# EAGLE schematic berlinerUhrSCH (EAGLE 9.7.0)
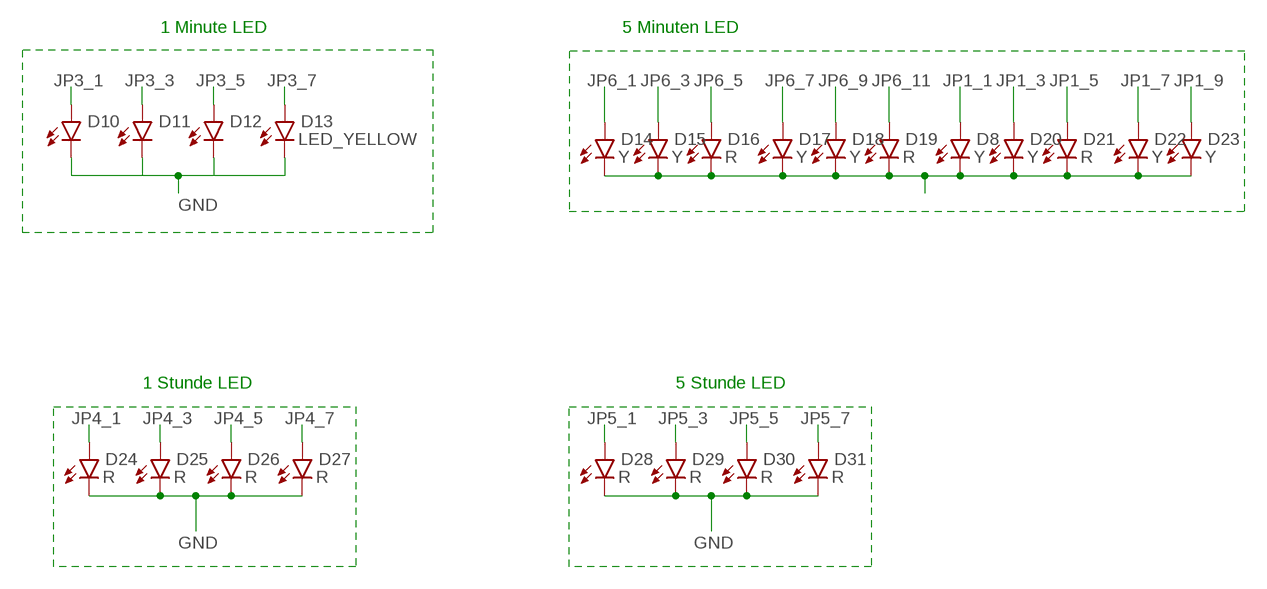
[diagram p0: schematic, sheet 1, part 1 of 2]
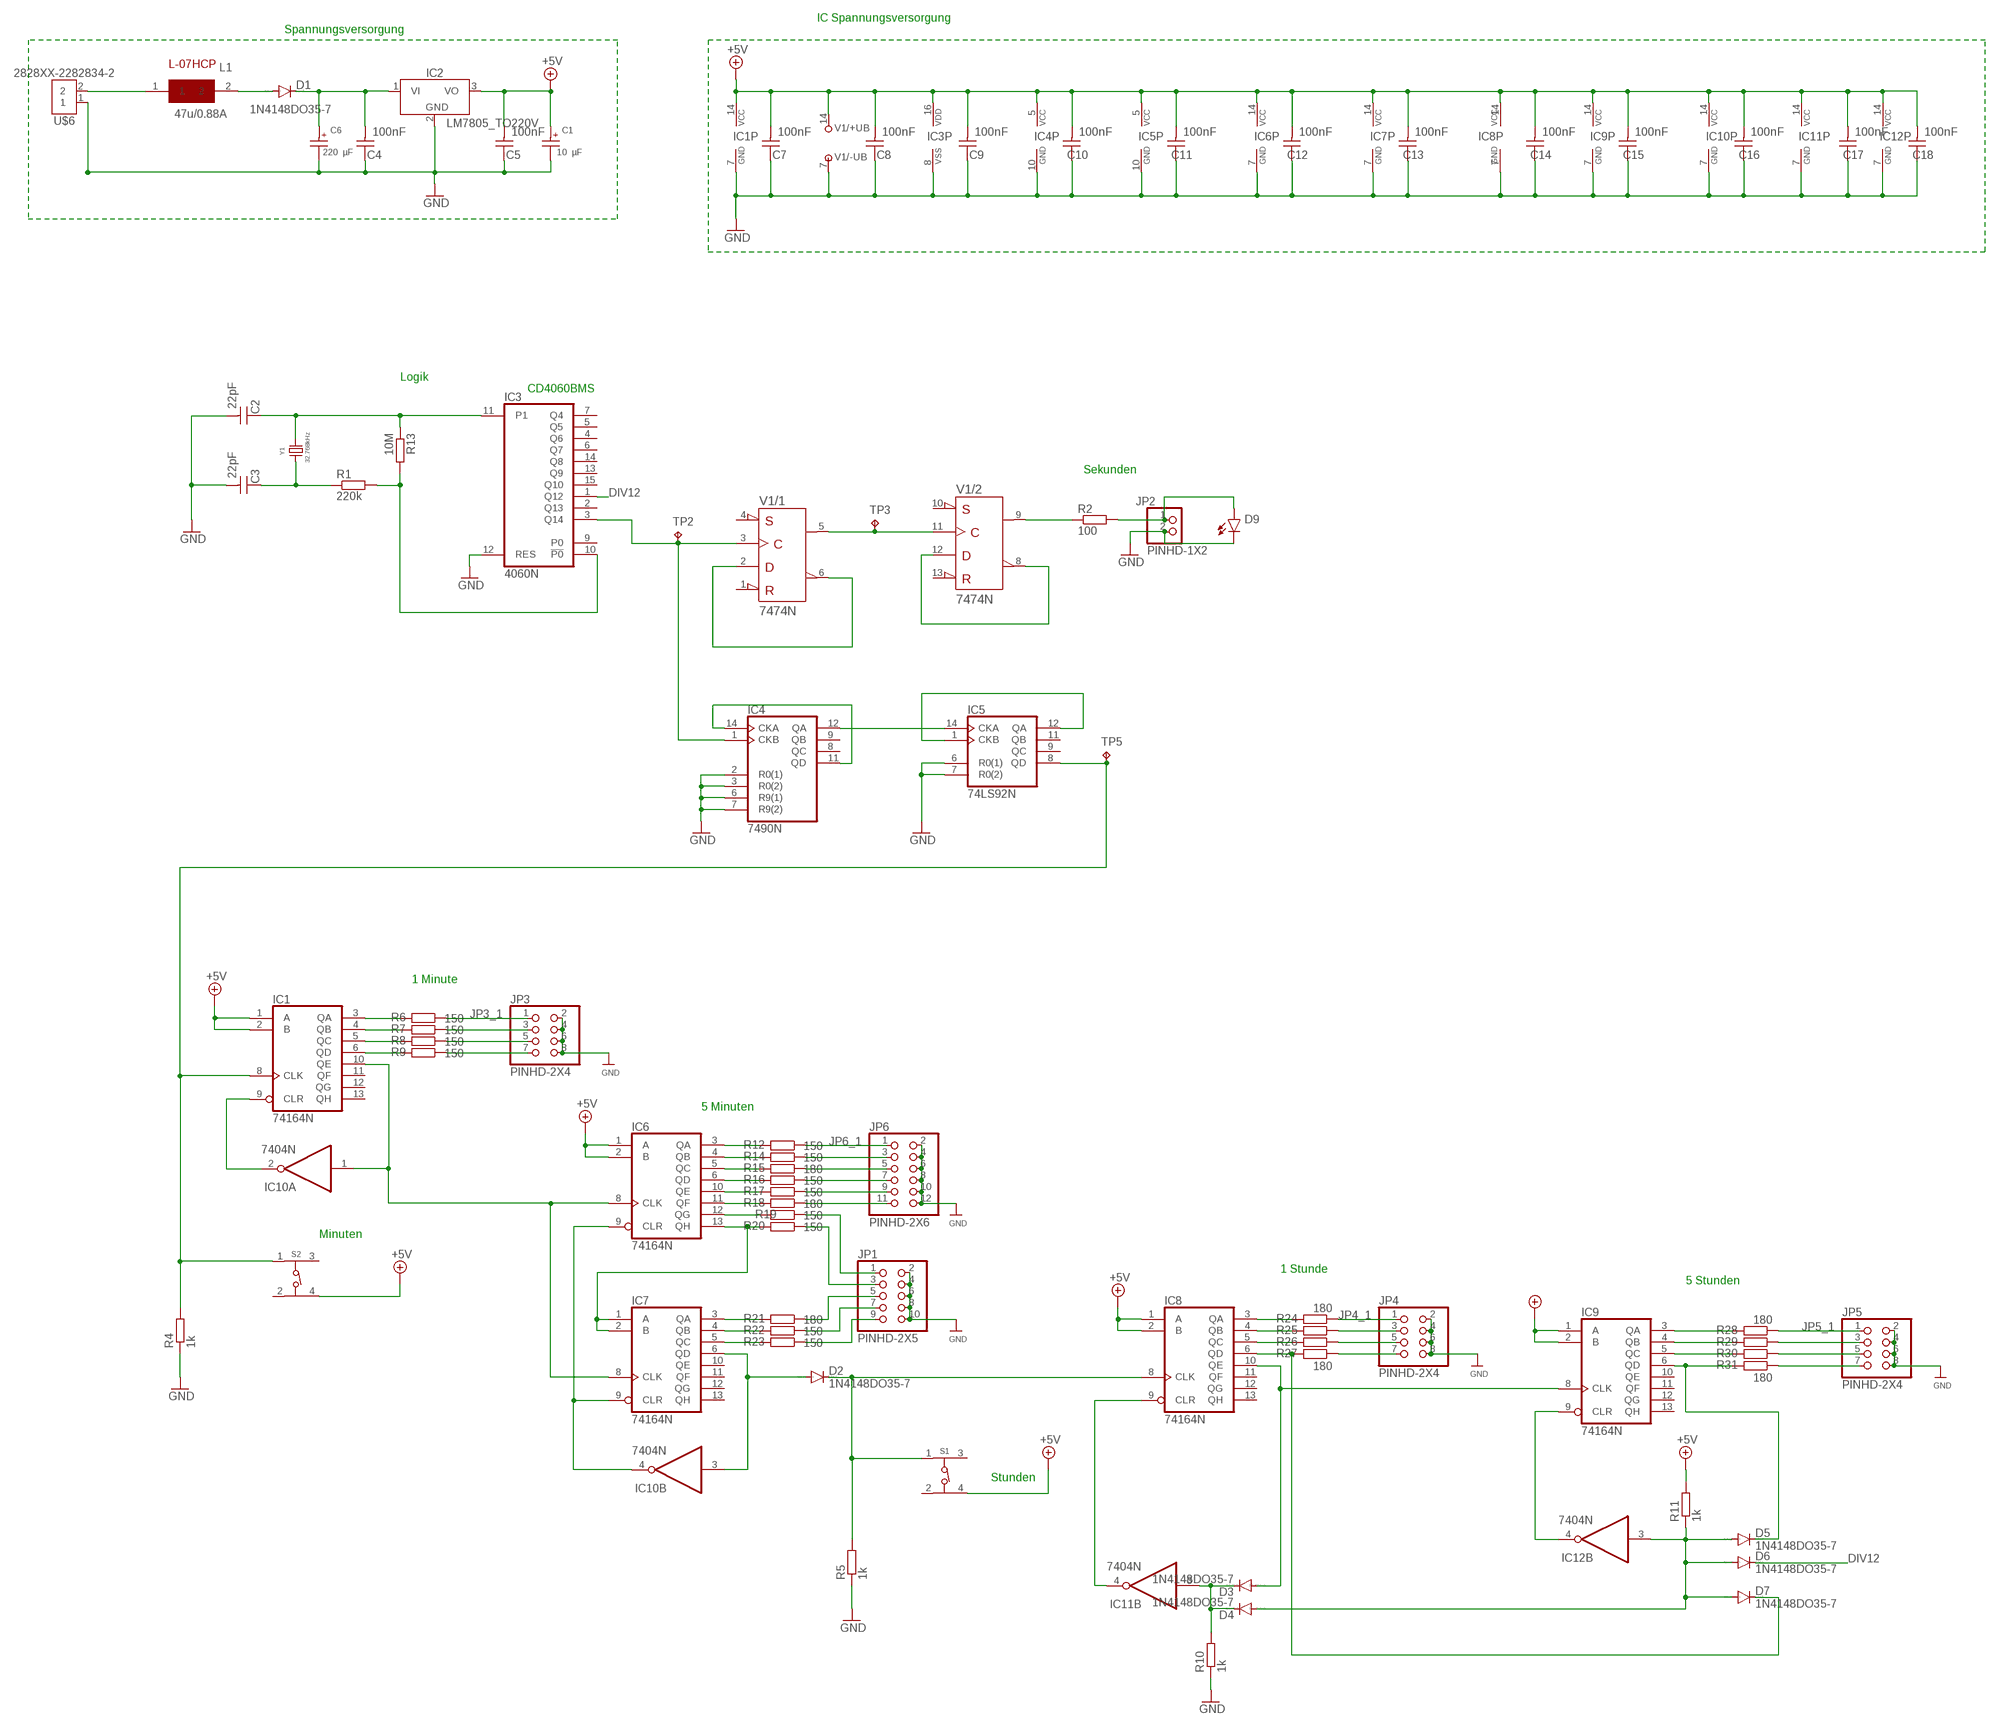
[diagram p1: schematic, sheet 1, part 2 of 2]

## Parts
C1  10 µF  WCAP-ATG8_10X12.5_860010275014  [WCAP-ATG8_10X12.5(DXL)]
C2  22pF  WCAP-CSGP_0805_H1.25_885012007067_50V(DC)  [WCAP-CSGP_0805_H1.25_R]
C3  22pF  WCAP-CSGP_0805_H1.25_885012007067_50V(DC)  [WCAP-CSGP_0805_H1.25_R]
C4  100nF  WCAP-CSGP_0805_H1.25_885012007067_50V(DC)  [WCAP-CSGP_0805_H1.25_R]
C5  100nF  WCAP-CSGP_0805_H1.25_885012007067_50V(DC)  [WCAP-CSGP_0805_H1.25_R]
C6  220 µF  WCAP-ATG8_10X12.5_860010275014  [WCAP-ATG8_10X12.5(DXL)]
C7  100nF  WCAP-CSGP_0805_H1.25_885012007067_50V(DC)  [WCAP-CSGP_0805_H1.25_R]
C8  100nF  WCAP-CSGP_0805_H1.25_885012007067_50V(DC)  [WCAP-CSGP_0805_H1.25_R]
C9  100nF  WCAP-CSGP_0805_H1.25_885012007067_50V(DC)  [WCAP-CSGP_0805_H1.25_R]
C10  100nF  WCAP-CSGP_0805_H1.25_885012007067_50V(DC)  [WCAP-CSGP_0805_H1.25_R]
C11  100nF  WCAP-CSGP_0805_H1.25_885012007067_50V(DC)  [WCAP-CSGP_0805_H1.25_R]
C12  100nF  WCAP-CSGP_0805_H1.25_885012007067_50V(DC)  [WCAP-CSGP_0805_H1.25_R]
C13  100nF  WCAP-CSGP_0805_H1.25_885012007067_50V(DC)  [WCAP-CSGP_0805_H1.25_R]
C14  100nF  WCAP-CSGP_0805_H1.25_885012007067_50V(DC)  [WCAP-CSGP_0805_H1.25_R]
C15  100nF  WCAP-CSGP_0805_H1.25_885012007067_50V(DC)  [WCAP-CSGP_0805_H1.25_R]
C16  100nF  WCAP-CSGP_0805_H1.25_885012007067_50V(DC)  [WCAP-CSGP_0805_H1.25_R]
C17  100nF  WCAP-CSGP_0805_H1.25_885012007067_50V(DC)  [WCAP-CSGP_0805_H1.25_R]
C18  100nF  WCAP-CSGP_0805_H1.25_885012007067_50V(DC)  [WCAP-CSGP_0805_H1.25_R]
D1  1N4148DO35-7  [DO35-7]
D2  1N4148DO35-7  [DO35-7]
D3  1N4148DO35-7  [DO35-7]
D4  1N4148DO35-7  [DO35-7]
D5  1N4148DO35-7  [DO35-7]
D6  1N4148DO35-7  [DO35-7]
D7  1N4148DO35-7  [DO35-7]
D8  Y  LED_RADIAL_YELLOW  [LEDRD254W60D565H860B_Y]
D9  LED_YELLOW  LED_RADIAL_YELLOW  [LEDRD254W60D565H860B_Y]
D10  LED_YELLOW  LED_RADIAL_YELLOW  [LEDRD254W60D565H860B_Y]
D11  LED_YELLOW  LED_RADIAL_YELLOW  [LEDRD254W60D565H860B_Y]
D12  LED_YELLOW  LED_RADIAL_YELLOW  [LEDRD254W60D565H860B_Y]
D13  LED_YELLOW  LED_RADIAL_YELLOW  [LEDRD254W60D565H860B_Y]
D14  Y  LED_RADIAL_YELLOW  [LEDRD254W60D565H860B_Y]
D15  Y  LED_RADIAL_YELLOW  [LEDRD254W60D565H860B_Y]
D16  R  LED_RADIAL_RED  [LEDRD254W60D565H860B]
D17  Y  LED_RADIAL_YELLOW  [LEDRD254W60D565H860B_Y]
D18  Y  LED_RADIAL_YELLOW  [LEDRD254W60D565H860B_Y]
D19  R  LED_RADIAL_RED  [LEDRD254W60D565H860B]
D20  Y  LED_RADIAL_YELLOW  [LEDRD254W60D565H860B_Y]
D21  R  LED_RADIAL_RED  [LEDRD254W60D565H860B]
D22  Y  LED_RADIAL_YELLOW  [LEDRD254W60D565H860B_Y]
D23  Y  LED_RADIAL_YELLOW  [LEDRD254W60D565H860B_Y]
D24  R  LED_RADIAL_RED  [LEDRD254W60D565H860B]
D25  R  LED_RADIAL_RED  [LEDRD254W60D565H860B]
D26  R  LED_RADIAL_RED  [LEDRD254W60D565H860B]
D27  R  LED_RADIAL_RED  [LEDRD254W60D565H860B]
D28  R  LED_RADIAL_RED  [LEDRD254W60D565H860B]
D29  R  LED_RADIAL_RED  [LEDRD254W60D565H860B]
D30  R  LED_RADIAL_RED  [LEDRD254W60D565H860B]
D31  R  LED_RADIAL_RED  [LEDRD254W60D565H860B]
IC1  74164N  [DIL14]
IC2  LM7805_TO220V  [TO220V]
IC3  4060N  [DIL16]
IC4  7490N  [DIL14]
IC5  74LS92N  [DIL14]
IC6  74164N  [DIL14]
IC7  74164N  [DIL14]
IC8  74164N  [DIL14]
IC9  74164N  [DIL14]
IC10  7404N  [DIL14]
IC11  7404N  [DIL14]
IC12  7404N  [DIL14]
JP1  PINHD-2X5  [2X05]
JP2  PINHD-1X2  [1X02]
JP3  PINHD-2X4  [2X04]
JP4  PINHD-2X4  [2X04]
JP5  PINHD-2X4  [2X04]
JP6  PINHD-2X6  [2X06]
L1  47u/0.88A  L-07HCP  [L-07HCP]
R1  220k  R_CHIP-1206(3216-METRIC)  [RESC3216X70]
R2  100  R_CHIP-1206(3216-METRIC)  [RESC3216X70]
R4  1k  R_CHIP-1206(3216-METRIC)  [RESC3216X70]
R5  1k  R_CHIP-1206(3216-METRIC)  [RESC3216X70]
R6  150  R_CHIP-1206(3216-METRIC)  [RESC3216X70]
R7  150  R_CHIP-1206(3216-METRIC)  [RESC3216X70]
R8  150  R_CHIP-1206(3216-METRIC)  [RESC3216X70]
R9  150  R_CHIP-1206(3216-METRIC)  [RESC3216X70]
R10  1k  R_CHIP-1206(3216-METRIC)  [RESC3216X70]
R11  1k  R_CHIP-1206(3216-METRIC)  [RESC3216X70]
R12  150  R_CHIP-1206(3216-METRIC)  [RESC3216X70]
R13  10M  R_CHIP-1206(3216-METRIC)  [RESC3216X70]
R14  150  R_CHIP-1206(3216-METRIC)  [RESC3216X70]
R15  180  R_CHIP-1206(3216-METRIC)  [RESC3216X70]
R16  150  R_CHIP-1206(3216-METRIC)  [RESC3216X70]
R17  150  R_CHIP-1206(3216-METRIC)  [RESC3216X70]
R18  180  R_CHIP-1206(3216-METRIC)  [RESC3216X70]
R19  150  R_CHIP-1206(3216-METRIC)  [RESC3216X70]
R20  150  R_CHIP-1206(3216-METRIC)  [RESC3216X70]
R21  180  R_CHIP-1206(3216-METRIC)  [RESC3216X70]
R22  150  R_CHIP-1206(3216-METRIC)  [RESC3216X70]
R23  150  R_CHIP-1206(3216-METRIC)  [RESC3216X70]
R24  180  R_CHIP-1206(3216-METRIC)  [RESC3216X70]
R25  180  R_CHIP-1206(3216-METRIC)  [RESC3216X70]
R26  180  R_CHIP-1206(3216-METRIC)  [RESC3216X70]
R27  180  R_CHIP-1206(3216-METRIC)  [RESC3216X70]
R28  180  R_CHIP-1206(3216-METRIC)  [RESC3216X70]
R29  180  R_CHIP-1206(3216-METRIC)  [RESC3216X70]
R30  180  R_CHIP-1206(3216-METRIC)  [RESC3216X70]
R31  180  R_CHIP-1206(3216-METRIC)  [RESC3216X70]
S1  430156070736  [4301X60707X6]
S2  430156070736  [4301X60707X6]
TP2  TPB1,27  [B1,27]
TP3  TPB1,27  [B1,27]
TP5  TPB1,27  [B1,27]
U$6  2828XX-2282834-2  [TERMBLK_254-2N]
V1  7474N  [DIL14]
Y1  32.768kHz  WE-XTAL_CFPX-56_830025159  [WE-XTAL_CFPX-56]

## Nets
1S: D9.1(A) JP2.1 R2.2
+5V: C1.1(+) C5.2 C7.2 C8.2 C9.2 C10.2 C11.2 C12.2 C13.2 C14.2 C15.2 C16.2 C17.2 C18.2 IC1.1(A) IC1.2(B) IC1.14(VCC) IC2.3(VO) IC3.16(VDD) IC4.5(VCC) IC5.5(VCC) IC6.1(A) IC6.2(B) IC6.14(VCC) IC7.14(VCC) IC8.1(A) IC8.2(B) IC8.14(VCC) IC9.1(A) IC9.2(B) IC9.14(VCC) IC10.14(P:VCC) IC11.14(P:VCC) IC12.14(P:VCC) R11.2 S1.4 S2.4 V1.14(/+UB:+UB)
DIV12: D6.C IC3.1(Q12)
GND: C1.2(-) C2.2 C3.2 C4.1 C5.1 C6.2(-) C7.1 C8.1 C9.1 C10.1 C11.1 C12.1 C13.1 C14.1 C15.1 C16.1 C17.1 C18.1 D9.2(C) D10.2(C) D13.2(C) D24.2(C) D25.2(C) D26.2(C) D27.2(C) D28.2(C) D29.2(C) D30.2(C) D31.2(C) IC1.7(GND) IC2.2(GND) IC3.8(VSS) IC3.12(RES) IC4.2(R0(1)) IC4.3(R0(2)) IC4.6(R9(1)) IC4.7(R9(2)) IC4.10(GND) IC5.6(R0(1)) IC5.7(R0(2)) IC5.10(GND) IC6.7(GND) IC7.7(GND) IC8.7(GND) IC9.7(GND) IC10.7(P:GND) IC11.7(P:GND) IC12.7(P:GND) JP1.2 JP1.4 JP1.6 JP1.8 JP1.10 JP2.2 JP3.2 JP3.4 JP3.6 JP3.8 JP4.2 JP4.4 JP4.6 JP4.8 JP5.2 JP5.4 JP5.6 JP5.8 JP6.2 JP6.4 JP6.6 JP6.8 JP6.10 JP6.12 R4.1 R5.1 R10.1 U$6.1 V1.7(/-UB:-UB)
JP1_1: D8.1(A) JP1.1 R19.1
JP1_3: D20.1(A) JP1.3 R20.1
JP1_5: D21.1(A) JP1.5 R21.1
JP1_7: D22.1(A) JP1.7 R22.1
JP1_9: D23.1(A) JP1.9 R23.1
JP3_1: D10.1(A) JP3.1 R6.1
JP3_3: D11.1(A) JP3.3 R7.1
JP3_5: D12.1(A) JP3.5 R8.1
JP3_7: D13.1(A) JP3.7 R9.1
JP4_1: D24.1(A) JP4.1 R24.1
JP4_3: D25.1(A) JP4.3 R25.1
JP4_5: D26.1(A) JP4.5 R26.1
JP4_7: D27.1(A) JP4.7 R27.1
JP5_1: D28.1(A) JP5.1 R28.1
JP5_3: D29.1(A) JP5.3 R29.1
JP5_5: D30.1(A) JP5.5 R30.1
JP5_7: D31.1(A) JP5.7 R31.1
JP6_1: D14.1(A) JP6.1 R12.1
JP6_3: D15.1(A) JP6.3 R14.1
JP6_5: D16.1(A) JP6.5 R15.1
JP6_7: D17.1(A) JP6.7 R16.1
JP6_9: D18.1(A) JP6.9 R17.1
JP6_11: D19.1(A) JP6.11 R18.1
N$1: C4.2 C6.1(+) D1.C IC2.1(VI)
N$3: D1.A L1.2
N$4: C3.1 R1.1 Y1.1
N$5: C2.1 IC3.11(P1) R13.1 Y1.2
N$6: IC3.10(!P0) R1.2 R13.2
N$7: IC3.3(Q14) IC4.1(CKB) TP2.TP V1.3(/1:CLK)
N$8: TP3.TP V1.5(/1:Q) V1.11(/2:CLK)
N$9: V1.2(/1:D) V1.6(/1:!Q)
N$10: V1.8(/2:!Q) V1.12(/2:D)
N$11: R2.1 V1.9(/2:Q)
N$13: IC4.11(QD) IC4.14(CKA)
N$14: IC4.12(QA) IC5.14(CKA)
N$15: IC5.1(CKB) IC5.12(QA)
N$16: IC1.8(CLK) IC5.8(QD) R4.2 S2.1 TP5.TP
N$17: IC1.3(QA) R6.2
N$18: IC6.13(QH) IC7.1(A) IC7.2(B) R20.2
N$19: IC1.10(QE) IC6.8(CLK) IC7.8(CLK) IC10.1(A:I)
N$20: IC1.9(CLR) IC10.2(A:O)
N$21: IC6.9(CLR) IC7.9(CLR) IC10.4(B:O)
N$22: IC8.9(CLR) IC11.4(B:O)
N$23: IC8.3(QA) R24.2
N$24: D2.C IC8.8(CLK) R5.2 S1.1
N$25: D3.A IC8.10(QE) IC9.8(CLK)
N$26: D4.A D5.A D6.A D7.A IC12.3(B:I) R11.1
N$27: IC9.9(CLR) IC12.4(B:O)
N$29: D3.C D4.C IC11.3(B:I) R10.2
N$30: D8.2(C) D14.2(C) D15.2(C) D16.2(C) D17.2(C) D18.2(C) D19.2(C) D20.2(C) D21.2(C) D22.2(C) D23.2(C)
N$31: D7.C IC8.6(QD) R27.2
N$32: IC1.4(QB) R7.2
N$34: IC1.5(QC) R8.2
N$36: IC1.6(QD) R9.2
N$38: IC6.3(QA) R12.2
N$39: L1.1 U$6.2
N$40: IC6.4(QB) R14.2
N$42: IC6.5(QC) R15.2
N$44: IC6.6(QD) R16.2
N$46: IC6.10(QE) R17.2
N$48: IC6.11(QF) R18.2
N$50: IC6.12(QG) R19.2
N$52: IC7.4(QB) R22.2
N$54: IC7.3(QA) R21.2
N$57: IC7.5(QC) R23.2
N$59: D2.A IC7.6(QD) IC10.3(B:I)
N$61: IC8.4(QB) R25.2
N$63: IC8.5(QC) R26.2
N$66: IC9.3(QA) R28.2
N$68: IC9.4(QB) R29.2
N$70: IC9.5(QC) R30.2
N$72: D5.C IC9.6(QD) R31.2
N$75: D12.2(C)
N$76: D11.2(C)
Unconnected: IC1.11(QF) IC1.12(QG) IC1.13(QH) IC3.2(Q13) IC3.4(Q6) IC3.5(Q5) IC3.6(Q7) IC3.7(Q4) IC3.9(P0) IC3.13(Q9) IC3.14(Q8) IC3.15(Q10) IC4.8(QC) IC4.9(QB) IC5.9(QC) IC5.11(QB) IC7.10(QE) IC7.11(QF) IC7.12(QG) IC7.13(QH) IC8.11(QF) IC8.12(QG) IC8.13(QH) IC9.10(QE) IC9.11(QF) IC9.12(QG) IC9.13(QH) IC10.5(C:I) IC10.6(C:O) IC10.8(D:O) IC10.9(D:I) IC10.10(E:O) IC10.11(E:I) IC10.12(F:O) IC10.13(F:I) IC11.1(A:I) IC11.2(A:O) IC11.5(C:I) IC11.6(C:O) IC11.8(D:O) IC11.9(D:I) IC11.10(E:O) IC11.11(E:I) IC11.12(F:O) IC11.13(F:I) IC12.1(A:I) IC12.2(A:O) IC12.5(C:I) IC12.6(C:O) IC12.8(D:O) IC12.9(D:I) IC12.10(E:O) IC12.11(E:I) IC12.12(F:O) IC12.13(F:I) S1.2 S1.3 S2.2 S2.3 V1.1(/1:!CLR) V1.4(/1:!PRE) V1.10(/2:!PRE) V1.13(/2:!CLR)

## Notes on the sheet
- IC Spannungsversorgung
- Spannungsversorgung
- 1 Minute LED | 5 Minuten LED
- 1 Stunde LED | 5 Stunde LED
- Logik
- CD4060BMS
- Sekunden
- 1 Minute
- 5 Minuten
- Minuten
- 1 Stunde
- 5 Stunden
- Stunden

## Library data of the parts
C1 C6 = Wurth_Capacitors_WCAP-ATG8:WCAP-ATG8_10X12.5: WCAP-ATG8 Aluminium Electrolytic Capacitors General Purpose +85 °C Characteristics General purpose product series with max. operating temperature of +85 °C Wide range of capacitance value Mounting style: THT Radial Capacitance range: 0.1 µF ‒ 33000 µF Capacitance tolerance: ±20 % Voltage range (UR): 10 ‒ 400 V(DC) Operating temperature: -40 °C up to +85 °C for UR < 400 V(DC) -25 °C up to +85 °C for UR ≥ 400 V(DC) Endurance: 2000 h @ +85 °C Dimensions (DxL) in mm: 5.0 x 11.0 up to 22.0 x 51.0 Recommended soldering: Wave soldering Applications Filtering Smoothing Energy storage Coupling <https://www.we-online.com/catalog/media/o35732v209%20WCAP-ATG8_4C.jpg> Details see: https://www.we-online.com/catalog/en/WCAP-ATG8/ Updated by yingchun,Shan;2020-02-27 2020(C) Würth Elektronik; DATASHEET-URL: https://www.we-online.com/catalog/datasheet/860010275014.pdf; DF: 19%; DIAMETER: 10mm; I-LEAK: 82uA; I-RIPPLE: 671mA; L: 12.5mm; OPERATING-TEMPERATURE: -40 °C up to +85 °C; PART-NUMBER: 860010275014; PITCH: 5mm; TECHNICAL-REFERENCE: ATBF125821M010DSPA9B000; VALUE: 820 µF; VR: 10V(DC)
C2-C5 C7-C18 = Wurth_Capacitors_WCAP-CSGP:WCAP-CSGP_0805_H1.25: WCAP-CSGP MLCCs 0805 General Purpose Characteristics General purpose product series High performance ceramic High electrical precision and stability ceramic especially for NP0 Minimal aging especially for NP0 Mounting style: SMT-Chip Ceramic: NP0 (Class I), X5R (Class II), X7R (Class II) Temperature coefficient: ±30 ppm/°C; ±0.54 % for NP0 ±15 % for X5R and X7R Operating temperature: -55 °C up to + 125 °C for NP0 and X7R -55 °C up to + 85 °C for X5R Termination: Cu/Ni/Sn Recommended soldering: Reflow soldering Wave soldering for size 0603 Wave soldering for size 0805 (only valid for the thickness ≤0.85 mm) Applications Temperature compensation (NP0) Coupling Decoupling Bypass Smoothing Filtering Resonant circuit <https://www.we-online.com/catalog/media/o177837v209%20MLCC_GRP_all.jpg> Details see: https://www.we-online.com/catalog/en/pbs/capacitors/multilayer_ceramic_chip_capacitors/mlcc_general_purpose Updated by Ella Wu 2022-09-02 2022(C) Würth Elektronik; CERAMIC-TYPE: NP0 Class I; DATASHEET-URL: https://www.we-online.com/redexpert/spec/885012007067?ae; DF: -; HEIGHT: 1.25mm; MOUNT: SMT; OPERATING-TEMPERATURE: -55 up to +125 °C; PART-NUMBER: 885012007067; QMIN: 1000; RISO: -; SIZE: 0805; TECHNICAL-REFERENCE: NP00805472J050DFCT10000; VALUE: 4.7nF; VR: 50V(DC)
D1 = diode:1N4148: DIODE high speed (Philips); SPICEMODEL: 1N4148Nexperia; SPICEMODELTEXT: *********************************************************** \n* \n* 1N4148 \n* \n* Nexperia \n* \n* High-speed diodes \n* IFmax = 200mA \n* VRmax = 100V \n* VFmax = 1V @ IF = 10mA \n* IRmax = 25nA @ VR = 20V \n* \n* \n* \n* Package pinning does not match Spice model pinning. \n* Package: SOD27 (DO-35) \n* \n* Package Pin 1: Cathode \n* Package Pin 2: Anode \n* \n* \n* \n* Extraction date (week/year): # \n* Simulator: PSPICE \n* \n*********************************************************** \n* \n* The resistor R1 does not reflect \n* a physical device. Instead it \n* improves modeling in the reverse \n* mode of operation. \n* \n.SUBCKT 1N4148 1 2 \nR1 1 2 5.827E+9 \nD1 1 2 1N4148 \n* \n.MODEL 1N4148 D \n+ IS = 4.352E-9 \n+ N = 1.906 \n+ BV = 110 \n+ IBV = 0.0001 \n+ RS = 0.6458 \n+ CJO = 7.048E-13 \n+ VJ = 0.869 \n+ M = 0.03 \n+ FC = 0.5 \n+ TT = 3.48E-9 \n.ENDS \n*; SPICEPREFIX: X
D2-D7 = diode:1N4148: DIODE high speed (Philips)
D8 D14 D15 D17 D18 D20 D22 D23 = Opto-Electronic:LED_RADIAL: LED - Generic; CATEGORY: Opto-Electronic; SUB-CATEGORY: LED; VALUE: LED_YELLOW
D9-D13 = Opto-Electronic:LED_RADIAL: LED - Generic; CATEGORY: Opto-Electronic; SUB-CATEGORY: LED
D16 D19 D21 D24-D31 = Opto-Electronic:LED_RADIAL: LED - Generic; CATEGORY: Opto-Electronic; SUB-CATEGORY: LED; VALUE: LED_RED
IC1 IC6-IC9 = 74xx-eu:74*164: 8-bit parallel out SHIFT REGISTER
IC2 = IC_Power-Management:LM7805: 5V Voltage Regulator Reference Datasheet <https://www.ti.com/lit/ds/symlink/lm340.pdf>; CATEGORY: IC_Linear; DESCRIPTION: 5V Voltage Regulator; MANUFACTURER: Generic; MPN: Generic; SERIES: LM7805; SUB-CATEGORY: Voltage Regulator; TYPE: 5V
IC3 = 40xx:4060: 14-stage binary/ripple COUNTER; SPICEPREFIX: X
IC4 = 74xx-eu:74*90: Decade, divide by twelve and binary COUNTER
IC5 = 74xx-eu:74*92: Decade, divide by twelve and binary COUNTER
IC10-IC12 = 74xx-eu:74*04: Hex INVERTER
JP1 = Connector:PINHD-2X5: PIN HEADER; CATEGORY: CONNECTOR; SUB-CATEGORY: PIN-HEADER
JP2 = Connector:PINHD-1X2: PIN HEADER; CATEGORY: CONNECTOR; SUB-CATEGORY: PIN-HEADER
JP3-JP5 = Connector:PINHD-2X4: PIN HEADER; CATEGORY: CONNECTOR; SUB-CATEGORY: PIN-HEADER
JP6 = Connector:PINHD-2X6: PIN HEADER; CATEGORY: CONNECTOR; SUB-CATEGORY: PIN-HEADER
L1 = InductorExtra:L-07HCP
R1 R2 R4-R31 = Resistor:R: Resistor Fixed - Generic; CATEGORY: Resistor; SUB-CATEGORY: Fixed
S1 S2 = Wurth_Switch_WS-TATV:430156070736: WS-TATV THT Tact Switch 6x6 mm Material Properties Cover Material : Stainless Steel Properties Actuator Material:LCP Actuator Flammability Rating:UL94 V-0 Actuator Color:Black; Salmon; White Frame Material:PPA Frame Flammability Rating:UL94 HB Frame Color:Black Contact Material:Stainless Steel Contact Plating:Silver Terminal Material:Copper Alloy Terminal Plating:Silver VR:12 V (DC) Contact Resistance Initial:100 mΩ Contact Resistance After Life Test:2 Ω RISO:100 MΩ Withstanding Voltage:250 V (AC) Washable:No Qty.:200 Mechanical Properties Stroke 0.25 mm General Information Operating Temperature:-40 up to +85 °C Washable:No Packaging Properties Packaging:Bulk <https://www.we-online.com/catalog/media/o61106v209%20Family_WS_TST_THT_4301x6xxx7x6_pf2.jpg> Details see: https://www.we-online.com/catalog/en/TATV_6X6_THT_4301x6xxx7x6/ Updated by yingchun,Shan;2020-02-21 2020(C) Würth Elektronik; DATASHEET-URL: https://www.we-online.com/catalog/datasheet/430156070736.pdf; H: 7.0mm; OPERATION-FORCE: 360g; PART-NUMBER: 430156070736; QTY: 200
TP2 TP3 TP5 = testpad:TP: Test pad
U$6 = Connector:2828XX-2: 2 Position Wire to Board Terminal Block Horizontal with Board Datasheet <https://www.te.com.cn/commerce/DocumentDelivery/DDEController?Action=showdoc&DocId=Catalog+Section%7F1308389_EUROSTYLE_TERMINAL_BLOCKS%7F0607%7Fpdf%7FEnglish%7FENG_CS_1308389_EUROSTYLE_TERMINAL_BLOCKS_0607.pdf%7F2-282837-5>
V1 = 74ttl-din:74*74: Dual D type positive edge triggered FLIP FLOP, preset and clear
Y1 = Wurth_Quartz Crystals & Oscillators_WE-XTAL:WE-XTAL_CFPX-56: WE-XTAL Watch Crystals Characteristics SMT and THT models Hermetically sealed Frequency: 32.768 kHz Tolerances down to ±10 ppm available Characteristics Microprocessor Real Time Clocks Test and Measurement Equipment Battery powered Applications <https://www.we-online.com/catalog/media/o162740v209%20Family_WE-XTAL_WatchCrystal.jpg> Details see: https://www.we-online.com/catalog/en/WE-XTAL_WATCHCRYSTAL Updated by Ella Wu, 2020-10-30 2020 (C) Wurth Elektronik; C-LOAD: 12.5pF; DATASHEET-URL: https://www.we-online.com/catalog/datasheet/830025159.pdf; MOUNT: SMT; PART-NUMBER: 830025159; TOLERANCE: ±20ppm